# EAGLE design persephone_B_v1 (EAGLE 9.6.2)

## Sheet 1 of 4: Power
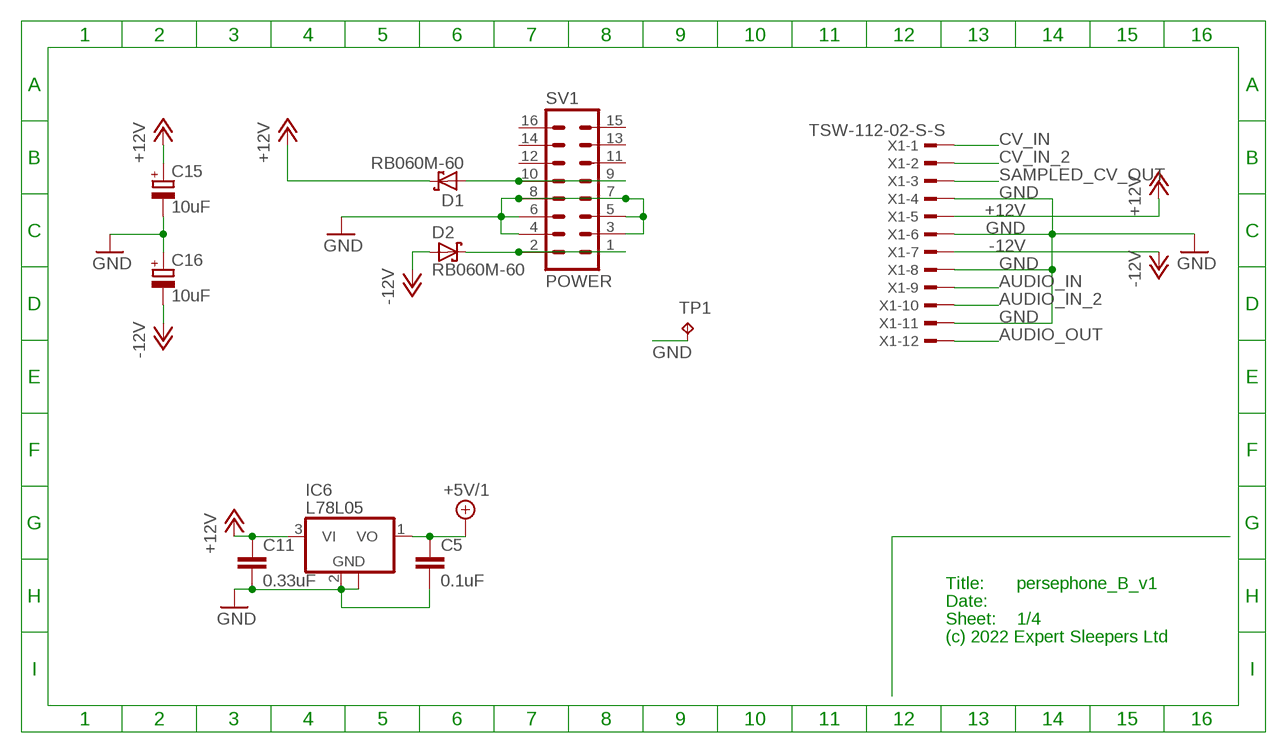
[diagram p0: schematic, sheet 1]

### Parts
C5  0.1uF  C-EUC0402  [C0402]
C11  0.33uF  C-EUC0805  [C0805]
C15  10uF  CPOL-EUUD-4X5,8  [UD-4X5,8_NICHICON]
C16  10uF  CPOL-EUUD-4X5,8  [UD-4X5,8_NICHICON]
D1  RB060M-60  [SOD123FL]
D2  RB060M-60  [SOD123FL]
IC6  L78L05  78L05F  [SOT89]
SV1  POWER  ML16  [ML16]
TP1  RA2  TPPAD1-13  [P1-13]
X1  TSW-112-02-S-S  [TSW-112-02-S-S]

### Nets
+5V/1: C5.1 IC6.1(VO) ; also sheet 3
+12V: C11.1 C15.+ D1.C IC6.3(VI) X1.5 ; also sheet 2,3,4
-12V: C16.- D2.A X1.7 ; also sheet 2,3,4
AUDIO_IN: X1.9 ; also sheet 2
AUDIO_IN_2: X1.10 ; also sheet 2
AUDIO_OUT: X1.12 ; also sheet 2
CV_IN: X1.1 ; also sheet 4
CV_IN_2: X1.2 ; also sheet 4
GND [power]: C5.2 C11.2 C15.- C16.+ IC6.2(GND) IC6.2@1(GND) SV1.3 SV1.4 SV1.5 SV1.6 SV1.7 SV1.8 TP1.TP X1.4 X1.6 X1.8 X1.11 ; also sheet 2,3,4
N$1: D2.C SV1.1 SV1.2
N$15: D1.A SV1.9 SV1.10
SAMPLED_CV_OUT: X1.3 ; also sheet 4
Unconnected: SV1.11 SV1.12 SV1.13 SV1.14 SV1.15 SV1.16

### Notes on the sheet
- Title:
- Date:
- Sheet:
- (c) 2022 Expert Sleepers Ltd

## Sheet 2 of 4: Audio path
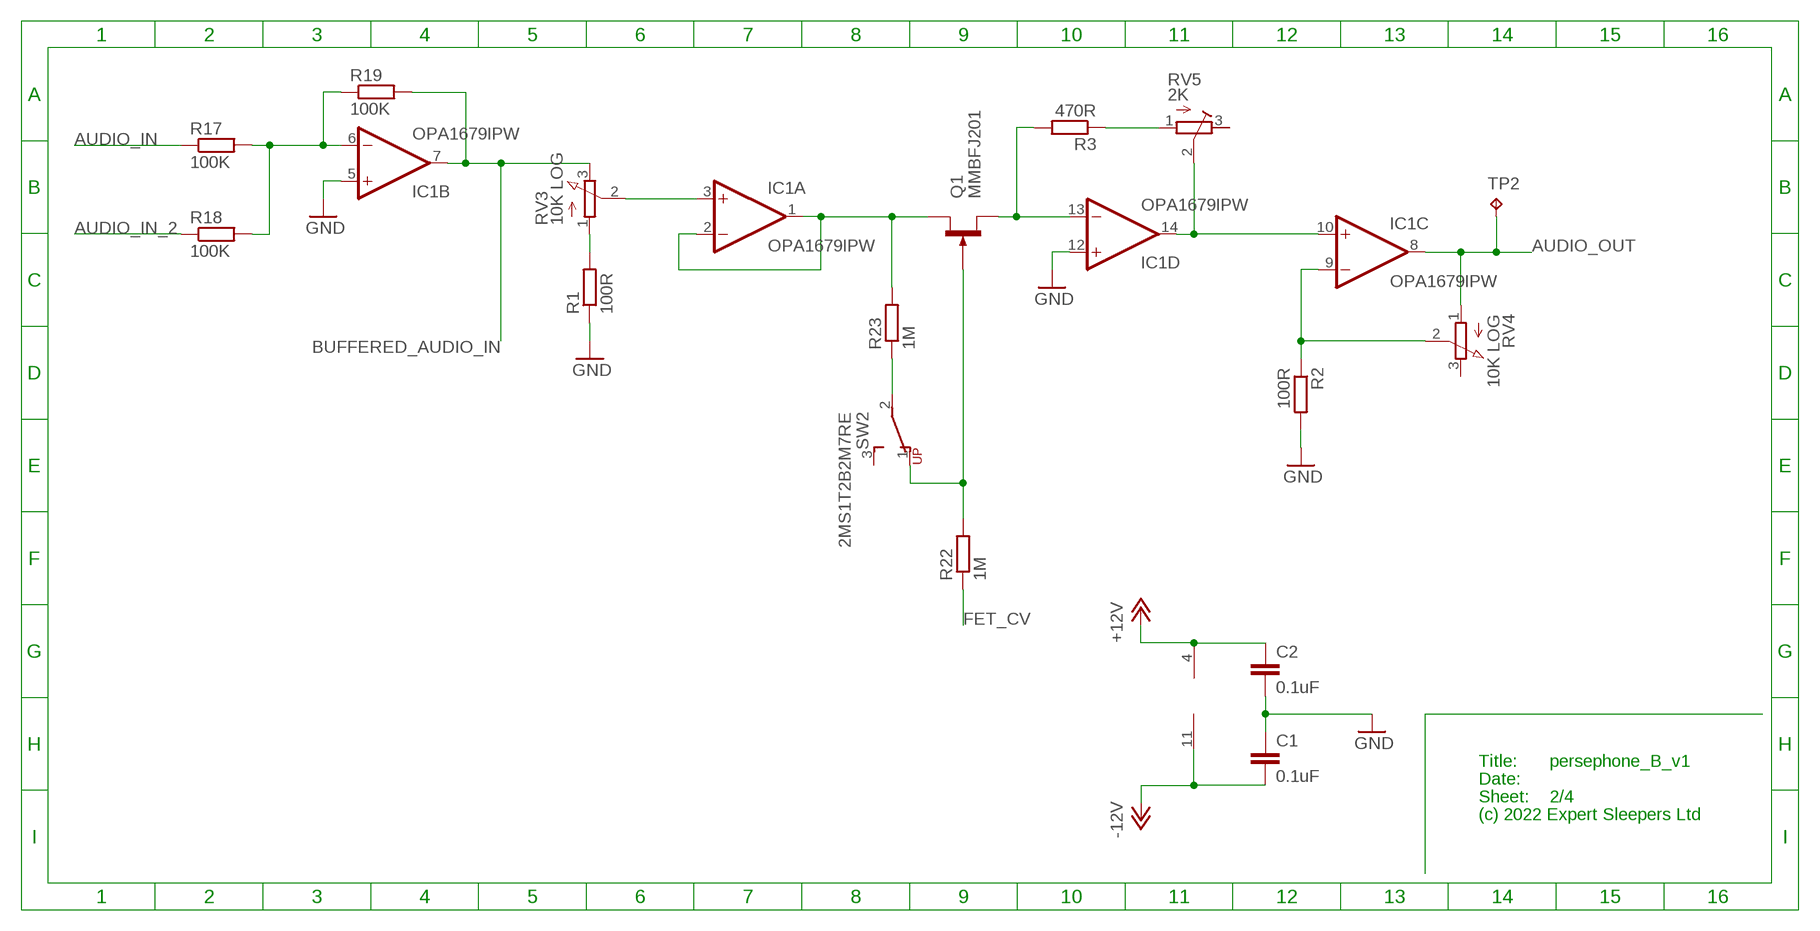
[diagram p1: schematic, sheet 2]

### Parts
C1  0.1uF  C-EUC0402  [C0402]
C2  0.1uF  C-EUC0402  [C0402]
IC1  OPA1679IPW  TL074PW  [PW_R-PDSO-G14]
Q1  MMBFJ201  MMBFJ3  [SOT23]
R1  100R  R-EU_R0603  [R0603]
R2  100R  R-EU_R0603  [R0603]
R3  470R  R-EU_R0603  [R0603]
R17  100K  R-EU_R0603  [R0603]
R18  100K  R-EU_R0603  [R0603]
R19  100K  R-EU_R0603  [R0603]
R22  1M  R-EU_R0603  [R0603]
R23  1M  R-EU_R0603  [R0603]
RV3  10K LOG  RD1610NOA0X  [RD1610NOA0X]
RV4  10K LOG  RD1610NOA0X  [RD1610NOA0X]
RV5  2K  TC33X  [TC33X]
SW2  2MS1T2B2M7RE  [2MS1T2B2M7RE]
TP2  RA2  TPPAD1-13  [P1-13]

### Nets
+12V: C2.1 IC1.4(P:V+) ; also sheet 1,3,4
-12V: C1.2 IC1.11(P:V-) ; also sheet 1,3,4
ATTEN_IN: IC1.3(A:+IN) RV3.2(S)
AUDIO_IN: R17.1 ; also sheet 1
AUDIO_IN_2: R18.1 ; also sheet 1
AUDIO_OUT: IC1.8(C:OUT) RV4.1(A) TP2.TP ; also sheet 1
BUFFERED_AUDIO_IN: IC1.7(B:OUT) R19.2 RV3.3(E) ; also sheet 3
FET_CV: R22.1 ; also sheet 4
GND [power]: C1.1 C2.2 IC1.5(B:+IN) IC1.12(D:+IN) R1.1 R2.2 ; also sheet 1,3,4
N$3: IC1.9(C:-IN) R2.1 RV4.2(S)
N$5: IC1.10(C:+IN) IC1.14(D:OUT) RV5.2(S)
N$10: IC1.1(A:OUT) IC1.2(A:-IN) Q1.1(D) R23.2
N$12: R1.2 RV3.1(A)
N$20: Q1.3(G) R22.2 SW2.1(RU)
N$23: R3.1 RV5.1(A)
N$24: IC1.13(D:-IN) Q1.2(S) R3.2
N$43: R23.1 SW2.2(PR)
N$44: IC1.6(B:-IN) R17.2 R18.2 R19.1
Unconnected: RV4.3(E) RV5.3(E) SW2.3(RD)

### Notes on the sheet
- Title:
- Date:
- Sheet:
- (c) 2022 Expert Sleepers Ltd

## Sheet 3 of 4: Sample & hold
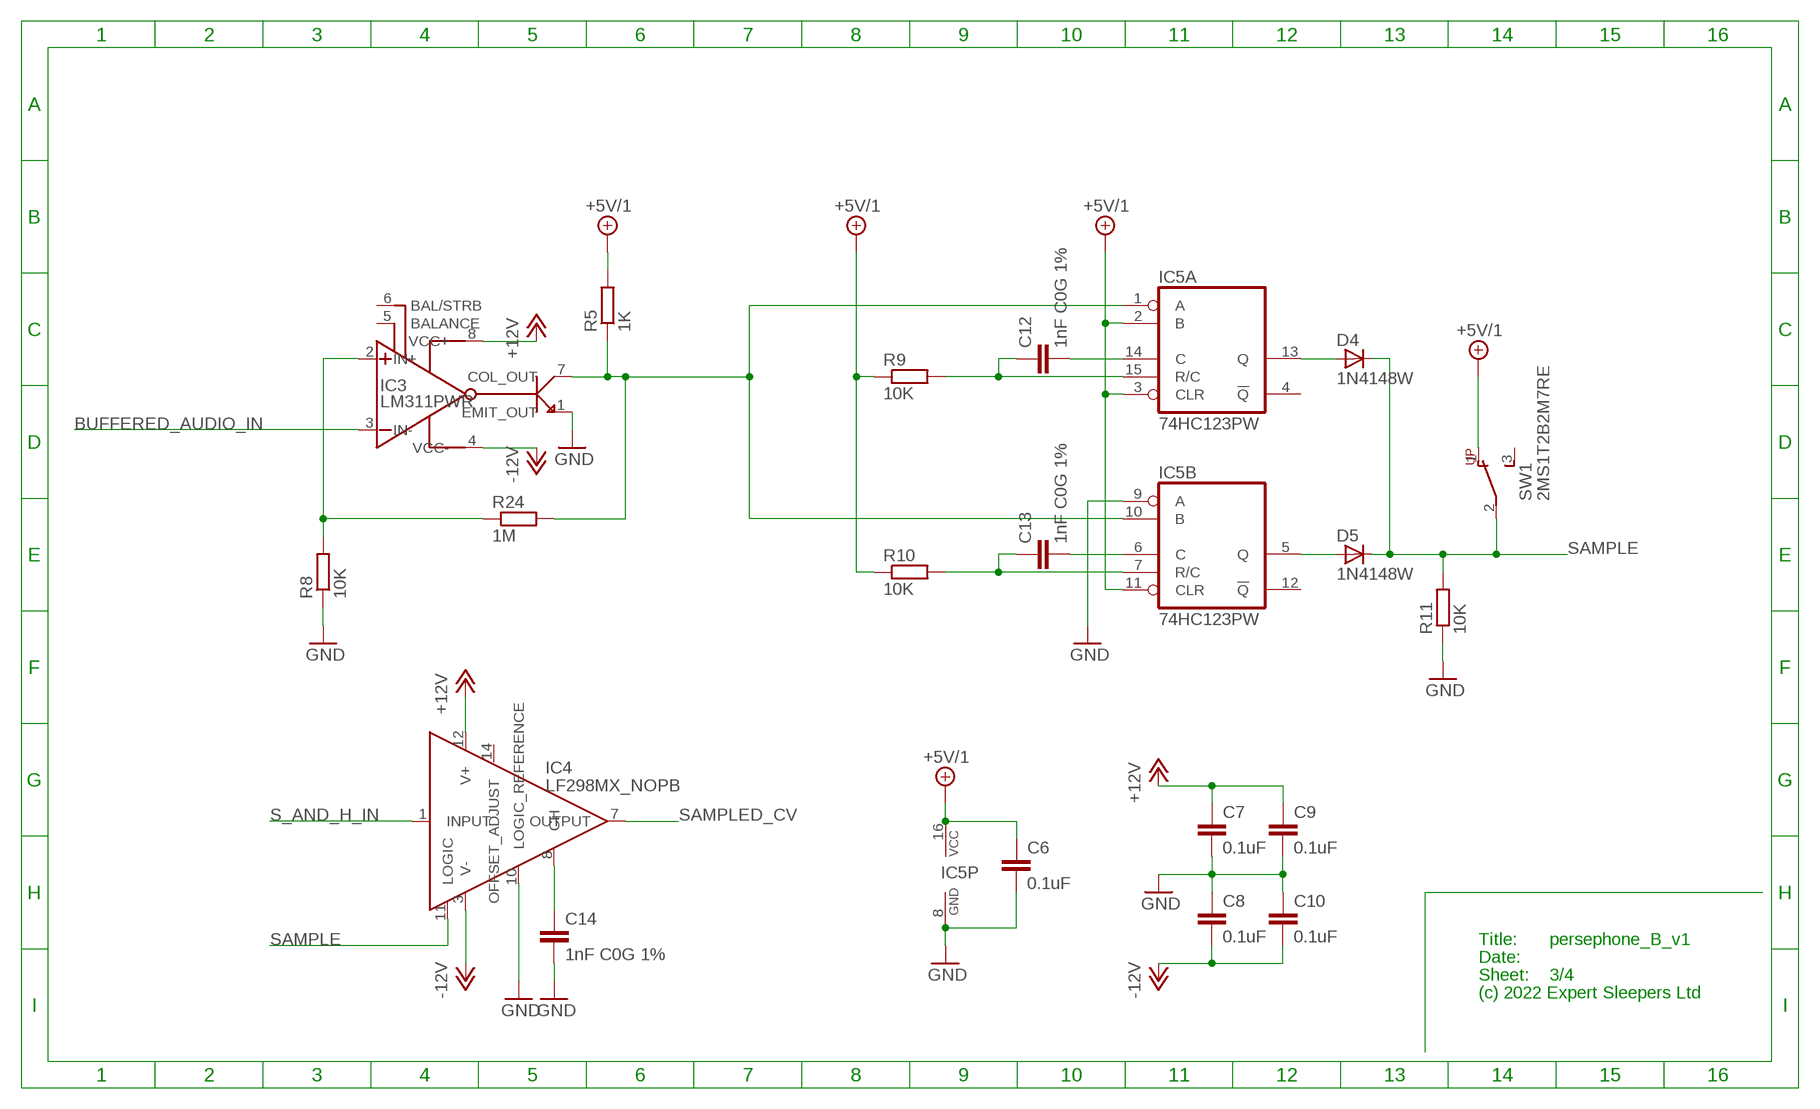
[diagram p2: schematic, sheet 3]

### Parts
C6  0.1uF  C-EUC0402  [C0402]
C7  0.1uF  C-EUC0402  [C0402]
C8  0.1uF  C-EUC0402  [C0402]
C9  0.1uF  C-EUC0402  [C0402]
C10  0.1uF  C-EUC0402  [C0402]
C12  1nF C0G 1%  C-EUC0603  [C0603]
C13  1nF C0G 1%  C-EUC0603  [C0603]
C14  1nF C0G 1%  C-EUC0603  [C0603]
D4  1N4148W  D-SOD123  [SOD123]
D5  1N4148W  D-SOD123  [SOD123]
IC3  LM311PWR  [SOP65P640X120-8N]
IC4  LF298MX_NOPB  [SOIC127P600X175-14N]
IC5  74HC123PW  [PW_R-PDSO-G16]
R5  1K  R-EU_R0603  [R0603]
R8  10K  R-EU_R0603  [R0603]
R9  10K  R-EU_R0603  [R0603]
R10  10K  R-EU_R0603  [R0603]
R11  10K  R-EU_R0603  [R0603]
R24  1M  R-EU_R0603  [R0603]
SW1  2MS1T2B2M7RE  [2MS1T2B2M7RE]

### Nets
+5V/1: C6.1 IC5.2(A:B) IC5.3(A:CLR) IC5.11(B:CLR) IC5.16(P:VCC) R5.2 R9.1 R10.1 SW1.1(RU) ; also sheet 1
+12V: C7.1 C9.1 IC3.8(VCC+) IC4.12(V+) ; also sheet 1,2,4
-12V: C8.2 C10.2 IC3.4(VCC-) IC4.3(V-) ; also sheet 1,2,4
BUFFERED_AUDIO_IN: IC3.3(IN-) ; also sheet 2
COMP_OUT: IC3.7(COL_OUT) IC5.1(A:A) IC5.10(B:B) R5.1 R24.2
GND [power]: C6.2 C7.2 C8.1 C9.2 C10.1 C14.2 IC3.1(EMIT_OUT) IC4.10(LOGIC_REFERENCE) IC5.8(P:GND) IC5.9(B:A) R8.1 R11.1 ; also sheet 1,2,4
N$35: IC3.2(IN+) R8.2 R24.1
N$36: C13.1 IC5.7(B:R/C) R10.2
N$37: C12.1 IC5.15(A:R/C) R9.2
N$38: D4.2(A) IC5.13(A:Q)
N$39: D5.2(A) IC5.5(B:Q)
N$40: C12.2 IC5.14(A:C)
N$41: C13.2 IC5.6(B:C)
N$42: C14.1 IC4.8(CH)
S_AND_H_IN: IC4.1(INPUT) ; also sheet 4
SAMPLE: D4.1(C) D5.1(C) IC4.11(LOGIC) R11.2 SW1.2(PR)
SAMPLED_CV: IC4.7(OUTPUT) ; also sheet 4
Unconnected: IC3.5(BALANCE) IC3.6(BAL/STRB) IC4.14(OFFSET_ADJUST) IC5.4(A:!Q) IC5.12(B:!Q) SW1.3(RD)

### Notes on the sheet
- Title:
- Date:
- Sheet:
- (c) 2022 Expert Sleepers Ltd

## Sheet 4 of 4: CV Input
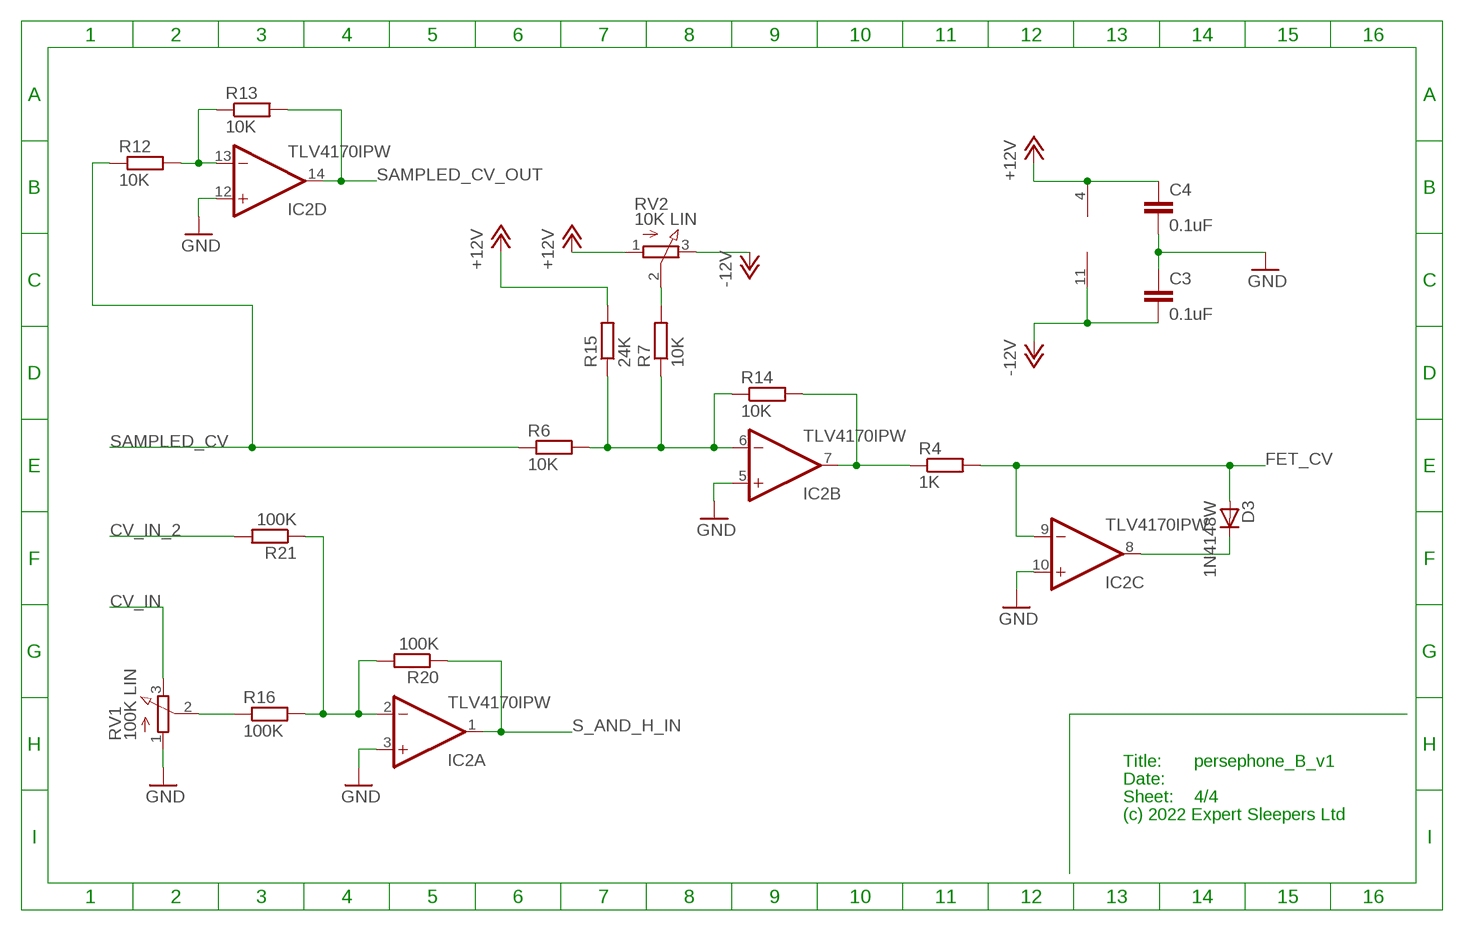
[diagram p3: schematic, sheet 4]

### Parts
C3  0.1uF  C-EUC0402  [C0402]
C4  0.1uF  C-EUC0402  [C0402]
D3  1N4148W  D-SOD123  [SOD123]
IC2  TLV4170IPW  TL074PW  [PW_R-PDSO-G14]
R4  1K  R-EU_R0603  [R0603]
R6  10K  R-EU_R0603  [R0603]
R7  10K  R-EU_R0603  [R0603]
R12  10K  R-EU_R0603  [R0603]
R13  10K  R-EU_R0603  [R0603]
R14  10K  R-EU_R0603  [R0603]
R15  24K  R-EU_R0603  [R0603]
R16  100K  R-EU_R0603  [R0603]
R20  100K  R-EU_R0603  [R0603]
R21  100K  R-EU_R0603  [R0603]
RV1  100K LIN  RD1610NOA0X  [RD1610NOA0X]
RV2  10K LIN  RD1610NOA0X  [RD1610NOA0X]

### Nets
+12V: C4.1 IC2.4(P:V+) R15.2 RV2.1(A) ; also sheet 1,2,3
-12V: C3.2 IC2.11(P:V-) RV2.3(E) ; also sheet 1,2,3
CV_IN: RV1.3(E) ; also sheet 1
CV_IN_2: R21.2 ; also sheet 1
FET_CV: D3.2(A) IC2.9(C:-IN) R4.2 ; also sheet 2
GND [power]: C3.1 C4.2 IC2.3(A:+IN) IC2.5(B:+IN) IC2.10(C:+IN) IC2.12(D:+IN) RV1.1(A) ; also sheet 1,2,3
N$7: IC2.2(A:-IN) R16.2 R20.2 R21.1
N$18: R16.1 RV1.2(S)
N$26: IC2.6(B:-IN) R6.2 R7.1 R14.1 R15.1
N$27: IC2.13(D:-IN) R12.2 R13.1
N$28: IC2.7(B:OUT) R4.1 R14.2
N$31: R7.2 RV2.2(S)
N$32: D3.1(C) IC2.8(C:OUT)
S_AND_H_IN: IC2.1(A:OUT) R20.1 ; also sheet 3
SAMPLED_CV: R6.1 R12.1 ; also sheet 3
SAMPLED_CV_OUT: IC2.14(D:OUT) R13.2 ; also sheet 1

### Notes on the sheet
- Title:
- Date:
- Sheet:
- (c) 2022 Expert Sleepers Ltd

## Library data of the parts
C1-C14 = rcl:C-EU: CAPACITOR, European symbol
C15 C16 = rcl:CPOL-EU: POLARIZED CAPACITOR, European symbol
D1 D2 = rohm2:RB060M-60: Schottky Barrier Diode
D3-D5 = semicon-smd-ipc:D-: DIODE unfilled
IC1 IC2 = digital-audio:TL074: OP AMP
IC3 = SamacSys_Parts:LM311PWR: High Speed, 30V, Differential Comparator With Strobes Source: Datasheet <http://www.ti.com/lit/ds/symlink/lm311.pdf>; ARROW_PART_NUMBER: LM311PWR; ARROW_PRICE-STOCK: https://www.arrow.com/en/products/lm311pwr/texas-instruments; DESCRIPTION: High Speed, 30V, Differential Comparator With Strobes; HEIGHT: 1.2mm; MANUFACTURER_NAME: Texas Instruments; MANUFACTURER_PART_NUMBER: LM311PWR; MOUSER_PART_NUMBER: 595-LM311PWR; MOUSER_PRICE-STOCK: https://www.mouser.co.uk/ProductDetail/Texas-Instruments/LM311PWR/?qs=YEaxc5757jOQ2Epklu87Vw%3D%3D
IC4 = SamacSys_Parts:LF298MX_NOPB: Sample and Hold 1-CH 20us 14-Pin SOIC T/R Source: Datasheet <https://www.arrow.com/en/products/lf298mxnopb/texas-instruments>; ARROW_PART_NUMBER: LF298MX/NOPB; ARROW_PRICE-STOCK: https://www.arrow.com/en/products/lf298mxnopb/texas-instruments?region=nac; DESCRIPTION: Sample and Hold 1-CH 20us 14-Pin SOIC T/R; HEIGHT: 1.75mm; MANUFACTURER_NAME: Texas Instruments; MANUFACTURER_PART_NUMBER: LF298MX/NOPB; MOUSER_PART_NUMBER: 926-LF298MX/NOPB; MOUSER_PRICE-STOCK: https://www.mouser.co.uk/ProductDetail/Texas-Instruments/LF298MX-NOPB?qs=X1J7HmVL2ZGolWOoaHgNzQ%3D%3D
IC5 = logic:74*123: Retriggerable monostable MULTIVIBRATOR
IC6 = linear:78L*: POSITOIV-VOLTAGE REGULATORS Output up to 100 mA Source: http://focus.ti.com/lit/ds/symlink/ua78l05.pdf
Q1 = transistor-small-signal:MMBFJ3*: N-Channel RF Amplifier Source: http://www.fairchildsemi.com/pf/J3/J310.html
R1-R24 = rcl:R-EU_: RESISTOR, European symbol
RV1-RV4 = soundwell:RD1610NOA0X: 16mm Potentiometer one level Source: http://www.alphapotentiometers.net/html/16mm_pot_2.html
RV5 = bourns:TC33X
SV1 = digital-audio:ML16: MULTICOMP - MC9A12-1634
SW1 SW2 = switch-multicomp:2MS1T2B2M7RE
TP1 TP2 = testpad:TP: Test pad
X1 = con-samtec:TSW-112-02-S-S: THROUGH-HOLE .025" SQ POST HEADER Source: Samtec TSW.pdf; OC_FARNELL: unknown; OC_NEWARK: unknown

## Board
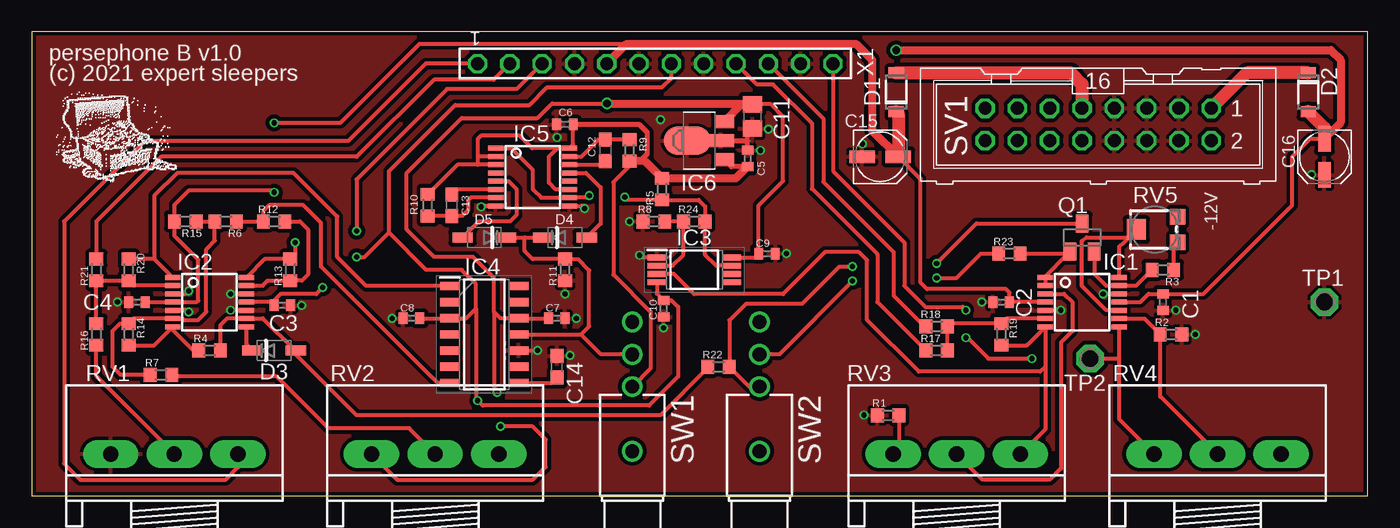
[diagram p4: board, top side]
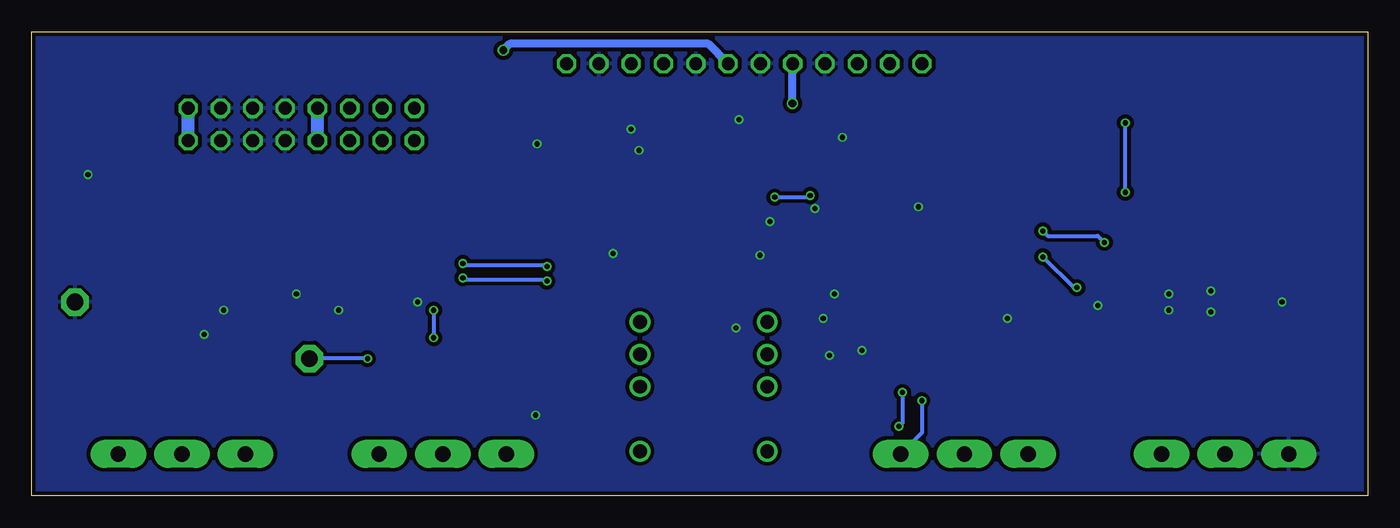
[diagram p5: board, bottom side, seen from below]

Size 105 x 36.5 mm. Coordinates in mm from the lower left corner, seen from the top.
Outline: 0,0 105,0 105,36.5 0,36.5 0,0
Copper layers (1*16): Top 0.035mm / dielectric 1.5mm / Bottom 0.035mm
Design rules "pcbtrain *": minimum track width 0.125mm, minimum drill 0.3mm, track to track 0.125mm, track to pad 0.125mm, pad to pad 0.125mm, via to via 0.125mm, smd to smd 0.125mm, copper to edge 0.25mm, drill to drill 8mil, minimum pad ring 0.15mm, minimum via ring 0.15mm, stop-mask expansion 4mil, vias tented up to drill 0mil, thermal gap 10mil

### Footprints (pad centres in the part's own frame; a part is rotated, then mirrored left to right if it is on the bottom)
C0402 = smd 0.7 x 0.9: 1 -0.65,0; 2 0.65,0
C0805 = smd 1.3 x 1.5: 1 -0.95,0; 2 0.95,0
C0603 = smd 1.1 x 1: 1 -0.85,0; 2 0.85,0
UD-4X5,8_NICHICON = smd 2 x 1: + 1.425,0; - -1.425,0
SOD123FL = smd 0.85 x 1.2: A 1.525,0; C -1.525,0
SOD123 = smd 1.6 x 0.8: 1 -1.7,0; 2 1.7,0
PW_R-PDSO-G14 = smd 0.4 x 1.2: 1 -1.95,-2.9; 2 -1.3,-2.9; 3 -0.65,-2.9; 4 0,-2.9; 5 0.65,-2.9; 6 1.3,-2.9; 7 1.95,-2.9; 8 1.95,2.9; 9 1.3,2.9; 10 0.65,2.9; 11 0,2.9; 12 -0.65,2.9; 13 -1.3,2.9; 14 -1.95,2.9
SOP65P640X120-8N = smd 1.475 x 0.45: 1 -2.938,0.975; 2 -2.938,0.325; 3 -2.938,-0.325; 4 -2.938,-0.975; 5 2.938,-0.975; 6 2.938,-0.325; 7 2.938,0.325; 8 2.938,0.975
SOIC127P600X175-14N = smd 1.525 x 0.65: 1 -2.712,3.81; 2 -2.712,2.54; 3 -2.712,1.27; 4 -2.712,0; 5 -2.712,-1.27; 6 -2.712,-2.54; 7 -2.712,-3.81; 8 2.712,-3.81; 9 2.712,-2.54; 10 2.712,-1.27; 11 2.712,0; 12 2.712,1.27; 13 2.712,2.54; 14 2.712,3.81
PW_R-PDSO-G16 = smd 0.4 x 1.2: 1 -1.95,-2.9; 2 -1.3,-2.9; 3 -0.65,-2.9; 4 0,-2.9; 5 0.65,-2.9; 6 1.3,-2.9; 7 1.95,-2.9; 8 2.6,-2.9; 9 2.6,2.9; 10 1.95,2.9; 11 1.3,2.9; 12 0.65,2.9; 13 0,2.9; 14 -0.65,2.9; 15 -1.3,2.9; 16 -1.95,2.9
SOT89 = smd 1 x 1.5: 1 -1.499,-1.981; 3 1.499,-1.981 | smd 1 x 2: 2 0,-1.727 | smd 2.2 x 3.7: 2@1 0,0.94
SOT23 = smd 1 x 1.4: 1 -0.95,-1.1; 2 0.95,-1.1; 3 0,1.1
R0603 = smd 1 x 1.1: 1 -0.85,0; 2 0.85,0
RD1610NOA0X = drill 1.2 pad 2.184 long: 1 -5,3.8; 2 0,3.8; 3 5,3.8
TC33X = smd 1.2 x 1.2: 1 -1,-1.8; 3 1,-1.8 | smd 1.6 x 1.5: 2 0,1.45
ML16 = drill 1.016 octagon: 1 -8.89,-1.27; 2 -8.89,1.27; 3 -6.35,-1.27; 4 -6.35,1.27; 5 -3.81,-1.27; 6 -3.81,1.27; 7 -1.27,-1.27; 8 -1.27,1.27; 9 1.27,-1.27; 10 1.27,1.27; 11 3.81,-1.27; 12 3.81,1.27; 13 6.35,-1.27; 14 6.35,1.27; 15 8.89,-1.27; 16 8.89,1.27
2MS1T2B2M7RE = drill 1.092: 1 0,5.08; 2 0,7.62; 3 0,10.16; 7 0,0
P1-13 = drill 1.321 pad 2.159 octagon: TP 0,0
TSW-112-02-S-S = drill 1 pad 1.5 octagon: 1 13.97,0; 2 11.43,0; 3 8.89,0; 4 6.35,0; 5 3.81,0; 6 1.27,0; 7 -1.27,0; 8 -3.81,0; 9 -6.35,0; 10 -8.89,0; 11 -11.43,0; 12 -13.97,0

### Placement (x,y rotation side)
C1  88.9,15.24 90 top
C2  76.2,15.24 180 top
C3  19.68,14.99 180 top
C4  8.26,15.24 180 top
C5  56.26,26.54 90 top
C6  41.91,29.21 180 top
C7  41.27,13.97 0 top
C8  29.84,13.97 0 top
C9  57.78,19.05 0 top
C10  49.66,14.73 90 top
C11  56.64,29.84 270 top
C12  45.09,27.18 270 top
C13  33.02,22.86 90 top
C14  41.27,10.16 90 top
C15  66.67,26.67 0 top
C16  101.6,26.67 270 top
D1  67.94,31.75 90 top
D2  100.33,31.75 270 top
D3  19.05,11.43 0 top
D4  41.91,20.32 0 top
D5  35.56,20.32 180 top
IC1  82.55,15.24 270 top
IC2  13.97,15.24 270 top
IC3  52.07,17.78 0 top
IC4  35.56,12.7 0 top
IC5  39.37,25.4 270 top
IC6  52.45,27.94 90 top
Q1  82.55,20.32 0 top
R1  67.31,6.35 0 top
R2  89.53,12.7 0 top
R3  88.9,17.78 180 top
R4  13.97,11.43 0 top
R5  49.53,24.13 90 top
R6  15.24,21.59 180 top
R7  10.16,9.53 0 top
R8  48.9,21.59 0 top
R9  46.99,27.18 90 top
R10  31.11,22.86 270 top
R11  41.91,17.78 90 top
R12  19.05,21.59 0 top
R13  20.32,17.78 90 top
R14  7.62,12.7 270 top
R15  12.06,21.59 180 top
R16  5.08,12.7 90 top
R17  71.12,11.43 0 top
R18  71.12,13.34 0 top
R19  76.2,12.7 270 top
R20  7.62,17.78 270 top
R21  5.08,17.78 90 top
R22  53.98,10.16 0 top
R23  76.83,19.05 0 top
R24  52.07,21.59 0 top
RV1  11.2,-0.5 0 top
RV2  31.7,-0.5 0 top
RV3  72.7,-0.5 0 top
RV4  93.2,-0.5 0 top
RV5  88.27,20.95 90 top
SV1  83.82,29.21 180 top
SW1  47.2,3.51 0 top
SW2  57.2,3.51 0 top
TP1  101.6,15.24 0 top
TP2  83.19,10.79 0 top
U$2  [TREASURE_10MM_300DPI]  1.54,24.66 0 top
X1  49,34 180 top

### Tracks (layer width: path | path; a pad name or v marks a point on that pad's centre or on a via)
+5V/1
  Top 0.305: C6.1 42.56,27.64 IC5.16 41.32,27.35 | IC5.11 41.18,24.1 40.64,24.64 40.64,26.67 41.32,27.35 | IC5.3 35.05,26.05 | 35.05,26.05 33.45,26.05 R10.1 | 41.32,27.35 39.33,27.35 38.35,28.32 35.31,28.32 35.05,28.07 35.05,26.67 | 35.05,26.67 35.05,26.05 | R9.1 46.99,25.95 45.72,24.68 45.72,17.4 48.64,14.48 48.64,10.03 SW1.1 | IC5.2 36.44,26.67 35.05,26.67
  Top 0.406: C5.1 54.98,25.89 IC6.1 | C6.1 47.75,29.21 48.39,28.57 48.39,26.91 47.81,26.33 R9.1
  Top 0.61: C5.1 55.35,24.98 R5.2 48.18,26.33 R9.1
+12V  (via drill 0.4, 0.6)
  Top 0.305: C4.1 IC2.4 12.95,15.24 13.08,15.37 13.08,18.58 11.21,20.45 R15.2 11.21,22.9 12.32,24 18.92,24 v19.05,23.88 | IC1.4 C2.1 76.85,15.99 76.58,16.26 70.37,16.26 69.85,16.78 69.85,24.92 C15.+ | IC3.8 56.84,18.75 C9.1 57.13,22.84 59.05,24.77 59.05,29.84 58.1,30.8 C11.1 | C7.1 IC4.12 36.83,13.97 36.32,14.48 | 36.32,14.48 36.32,17.14 34.67,18.8 31.62,18.8 29.46,20.95 29.46,25.4 33.78,29.72 39.75,29.72 40.89,30.86 v45.21,30.86 | RV2.1 28.73,1.27 39.37,1.27 40.39,2.29 40.39,4.45 39.37,5.46 v36.83,5.46 | v36.58,8.13 36.32,8.38 36.32,14.48 | v19.05,29.34 24.26,29.34 30.48,35.56 46.75,35.56
  Top 0.61: IC6.3 55.79,30.8 C11.1 56.58,30.86 v45.21,30.86 | X1.5 46.75,35.56 64.77,35.56 66.04,34.29 66.04,28.73 C15.+
  Top 1.016: D1.C 68.1,30.07 C15.+
  Bottom 0.305: 45.21,33.98 X1.5 | v36.83,5.46 36.58,5.71 v36.58,8.13 | v19.05,23.88 v19.05,29.34
  Bottom 0.61: v45.21,30.86 45.21,33.98
-12V  (via drill 0.4, 0.6)
  Top 0.305: IC2.11 18.78,15.24 C3.2 19.04,15.35 19.56,15.88 22.35,15.88 v22.86,16.38 | C8.2 IC4.3 34.14,13.97 34.9,14.73 | IC1.11 87.12,15.24 87.77,15.89 C1.2 92.09,15.89 99.06,22.86 99.06,26.67 100.48,28.09 C16.- | 34.9,14.73 34.9,7.64 v35.05,7.49 35.43,7.11 48.51,7.11 50.8,9.4 50.8,14.86 50.28,15.38 C10.2 49.13,15.91 IC3.4 | 34.9,14.73 34.9,16.66 33.78,17.78 30.99,17.78 28.07,20.7 | X1.7 50.27,32.87 49.53,32.13 40.51,32.13 39.12,30.73 33.27,30.73 28.07,25.53 28.07,20.7 | 28.07,20.7 26.16,18.8 v25.53,18.8
  Top 0.61: v67.94,35.05 102.11,35.05 102.87,34.29 102.87,29.36 C16.-
  Top 1.016: D2.A 101.6,28.95 C16.-
  Bottom 0.305: RV2.3 35.05,4.95 v35.05,7.49 | v25.53,18.8 23.11,16.38 v22.86,16.38
  Bottom 0.61: X1.7 51.83,35.56 67.44,35.56 v67.94,35.05
ATTEN_IN
  Top 0.305: IC1.3 81.14,15.89 81.79,15.24 81.79,12.95 80.9,12.06 80.9,2.16 80.01,1.27 74.73,1.27 RV3.2
AUDIO_IN
  Top 0.305: X1.9 57,32.35 58.27,32.35 61.32,29.3 61.32,24.15 66.46,19.01 66.46,15.24 R17.1
AUDIO_IN_2
  Top 0.305: R18.1 70.14,13.34 67.73,15.75 67.73,19.18 62.21,24.7 62.21,29.68 X1.10
AUDIO_OUT  (via drill 0.4)
  Top 0.305: IC1.8 85.45,10.79 | 85.45,10.79 85.45,6.05 RV4.1 | TP2.TP 85.45,10.79 | X1.12 62.97,25.55 68.58,19.94 68.58,16.51 70.23,14.86 73.15,14.86 v73.41,14.61 | v73.41,12.45 73.53,12.45 75.18,10.79 v78.61,10.79
  Bottom 0.305: v73.41,14.61 v73.41,12.45 | v78.61,10.79 TP2.TP
BUFFERED_AUDIO_IN
  Top 0.305: 79.65,10.16 IC1.7 78.21,11.85 R19.2 | 79.65,10.16 79.65,5.25 RV3.3 | 79.65,10.16 79.27,9.78 69.72,9.78 65.66,13.84 65.66,18.54 65.02,19.18 62.36,19.18 59.05,15.88 52.05,15.88 50.47,17.45 IC3.3
COMP_OUT  (via drill 0.4)
  Top 0.305: IC3.7 53.78,18.11 52.92,18.96 R24.2 52.92,22.77 52.41,23.28 R5.1 46.82,23.28 v46.61,23.5 | IC5.1 37.67,27.35 39.37,25.65 39.37,24.13 40.05,23.45 IC5.10 43.64,23.45 v43.81,23.62
  Bottom 0.305: v46.61,23.5 43.94,23.5 v43.81,23.62
CV_IN
  Top 0.305: X1.1 30.97,34 24.87,27.9 8.85,27.9 2.54,21.59 2.54,2.54 3.81,1.27 15.24,1.27 16.2,2.23 RV1.3
CV_IN_2
  Top 0.305: R21.2 5.08,21.59 10.16,26.67 25.54,26.67 31.6,32.73 36.3,32.73 X1.2
FET_CV
  Top 0.305: R4.2 14.82,13.42 15.34,13.94 IC2.9 16.9,13.97 18.16,13.97 20.7,11.43 D3.2 20.75,11.13 25.53,6.35 49.4,6.35 53.12,10.07 R22.1
GND  (via drill 0.4)
  Top 0.305: IC2.5 11.09,14.61 12.19,14.61 v12.32,14.48 | IC2.3 12.08,15.89 v12.32,16.13 | IC2.12 16.86,15.88 v15.62,15.88 | IC2.10 15.64,14.59 v15.62,14.61 | IC3.1 47.92,18.75 v47.75,18.92 | IC4.10 v39.75,11.43 | IC5.8 35.37,22.8 v35.31,22.73 | IC5.9 43.24,22.8 v43.43,22.61 | IC1.5 79.67,14.61 v80.9,14.61 | IC1.12 85.44,15.88 v84.2,15.88
  Top 0.406: C5.2 56.26,27.94 | 56.26,27.94 56.26,28.51 C11.2 | IC6.2 56.26,27.94
  other vias: 6.73,15.24 21.21,14.99 89.92,14.61 74.68,15.24 91.44,12.7 65.41,6.35 49.66,13.21 59.31,19.05 46.99,21.59 42.8,13.97 28.32,13.97 42.29,11.05 41.27,28.19 41.91,15.88 57.28,27.18 57.91,28.83 65.28,27.69 100.58,25.27 49.4,29.59
  pour Top (isolate 0.305): 0,0 105,0 105,36.5 0,36.5
  pour Bottom (isolate 0.305): 0,0 105,0 105,36.5 0,36.5
N$1
  Top 1.016: D2.C 95.5,33.27 SV1.1
  Bottom 1.016: SV1.2 SV1.1
N$3
  Top 0.305: IC1.9 87.44,13.94 R2.1 88.69,7.82 RV4.2
N$5
  Top 0.305: RV5.2 86.27,20.32 | 86.27,20.32 85.45,19.59 IC1.14 | IC1.10 84.47,14.59 82.55,16.51 82.55,20.07 82.89,20.32 86.27,20.32
N$7
  Top 0.305: R16.2 R21.1 R20.2 8.01,16.54 IC2.2
N$10
  Top 0.305: IC1.2 IC1.1 79.65,17.27 81.36,18.98 | Q1.1 81.36,18.98 | R23.2 81.28,19.05 81.36,18.98
N$12
  Top 0.305: R1.2 68.16,3.76 RV3.1
N$15
  Top 1.016: D1.A 81.66,33.27 82.55,32.38 SV1.9
  Bottom 1.016: SV1.10 SV1.9
N$18
  Top 0.305: RV1.2 5.08,9.42 R16.1
N$20  (via drill 0.4)
  Top 0.305: v64.52,18.03 63.47,18.03 60.55,15.11 56.13,15.11 54.83,13.8 R22.2 56.4,8.59 SW2.1 | v71.12,18.29 74.25,21.42 Q1.3
  Bottom 0.305: v64.52,18.03 64.64,18.16 70.99,18.16 v71.12,18.29
N$23
  Top 0.305: R3.1 89.75,19.64 RV5.1
N$24
  Top 0.305: Q1.2 83.5,17.46 84.42,16.54 IC1.13 86.81,16.54 R3.2
N$26
  Top 0.305: R15.1 R6.2 14.39,20.07 13.72,19.39 13.72,14.48 13.05,13.81 11.96,13.81 11.83,13.94 IC2.6 8.01,13.94 R14.1 6.95,13.55 6.35,12.95 6.35,10.16 6.99,9.53 R7.1
N$27
  Top 0.305: IC2.13 18.15,16.54 18.54,16.93 R13.1 21.25,16.93 21.72,17.4 21.72,20.95 21.08,21.59 R12.2
N$28
  Top 0.305: R14.2 9.63,11.85 10.96,13.18 | 10.96,13.18 IC2.7 | R4.1 12.7,11.43 10.96,13.18
N$31
  Top 0.305: RV2.2 29.67,5.33 23.32,5.33 19.25,9.4 11.14,9.4 R7.2
N$32
  Top 0.305: D3.1 16.87,11.91 IC2.8
N$35
  Top 0.305: IC3.2 50.36,18.11 51.22,18.96 R24.1 R8.2
N$36
  Top 0.305: IC5.7 34.5,23.45 34.29,23.24 34.29,22.48 33.82,22.01 C13.1 R10.2
N$37
  Top 0.305: IC5.15 43.21,26.7 44.54,28.03 C12.1 R9.2
N$38
  Top 0.305: IC5.13 43.56,25.4 44.7,24.26 44.7,21.41 D4.2
N$39
  Top 0.305: IC5.5 37.48,24.75 38.1,24.13 38.1,22.1 37.59,21.59 35.13,21.59 D5.2
N$40
  Top 0.305: IC5.14 44.81,26.05 C12.2
N$41
  Top 0.305: IC5.6 33.41,24.1 C13.2
N$42
  Top 0.305: IC4.8 40.85,8.89 C14.1
N$43  (via drill 0.4)
  Top 0.305: v64.52,16.89 58.76,11.13 SW2.2 | v71.12,17.14 72.68,17.14 74.59,19.05 R23.1
  Bottom 0.305: v64.52,16.89 64.64,17.02 70.99,17.02 v71.12,17.14
N$44
  Top 0.305: IC1.6 76.59,13.94 R19.1 72.19,13.55 R18.2 R17.2
S_AND_H_IN
  Top 0.305: IC2.1 9.63,18.63 | 9.63,18.63 R20.1 | 9.63,18.63 9.63,23.6 11.43,25.4 20.57,25.4 24,21.97 24,18.8 26.29,16.51 IC4.1
SAMPLE
  Top 0.305: D5.1 38.73,20.32 | 38.73,20.32 D4.1 | 38.73,20.32 38.73,19.27 39.37,18.63 R11.2 42.93,18.63 43.81,17.74 43.81,13.34 43.18,12.7 | IC4.11 43.18,12.7 | 43.18,12.7 44.75,11.13 SW1.2
SAMPLED_CV
  Top 0.305: R6.1 R12.1 18.2,22.39 18.67,22.86 21.34,22.86 22.73,21.46 22.73,18.03 31.88,8.89 IC4.7
SAMPLED_CV_OUT  (via drill 0.4)
  Top 0.305: IC2.14 18.31,18.63 R13.2 20.7,19.01 v20.7,19.94 | X1.3 38.11,32 32.64,32 25.53,24.89 v25.53,20.83
  Bottom 0.305: v25.53,20.83 25.15,20.45 21.21,20.45 v20.7,19.94

### Text on the board
tPlace: persephone B v1.0 | (c) 2021 expert sleepers | -12V